# Altium schematic sheet imx6_unused_pin.SchDoc
size A4; SheetNumber: 21; SheetTotal: 21
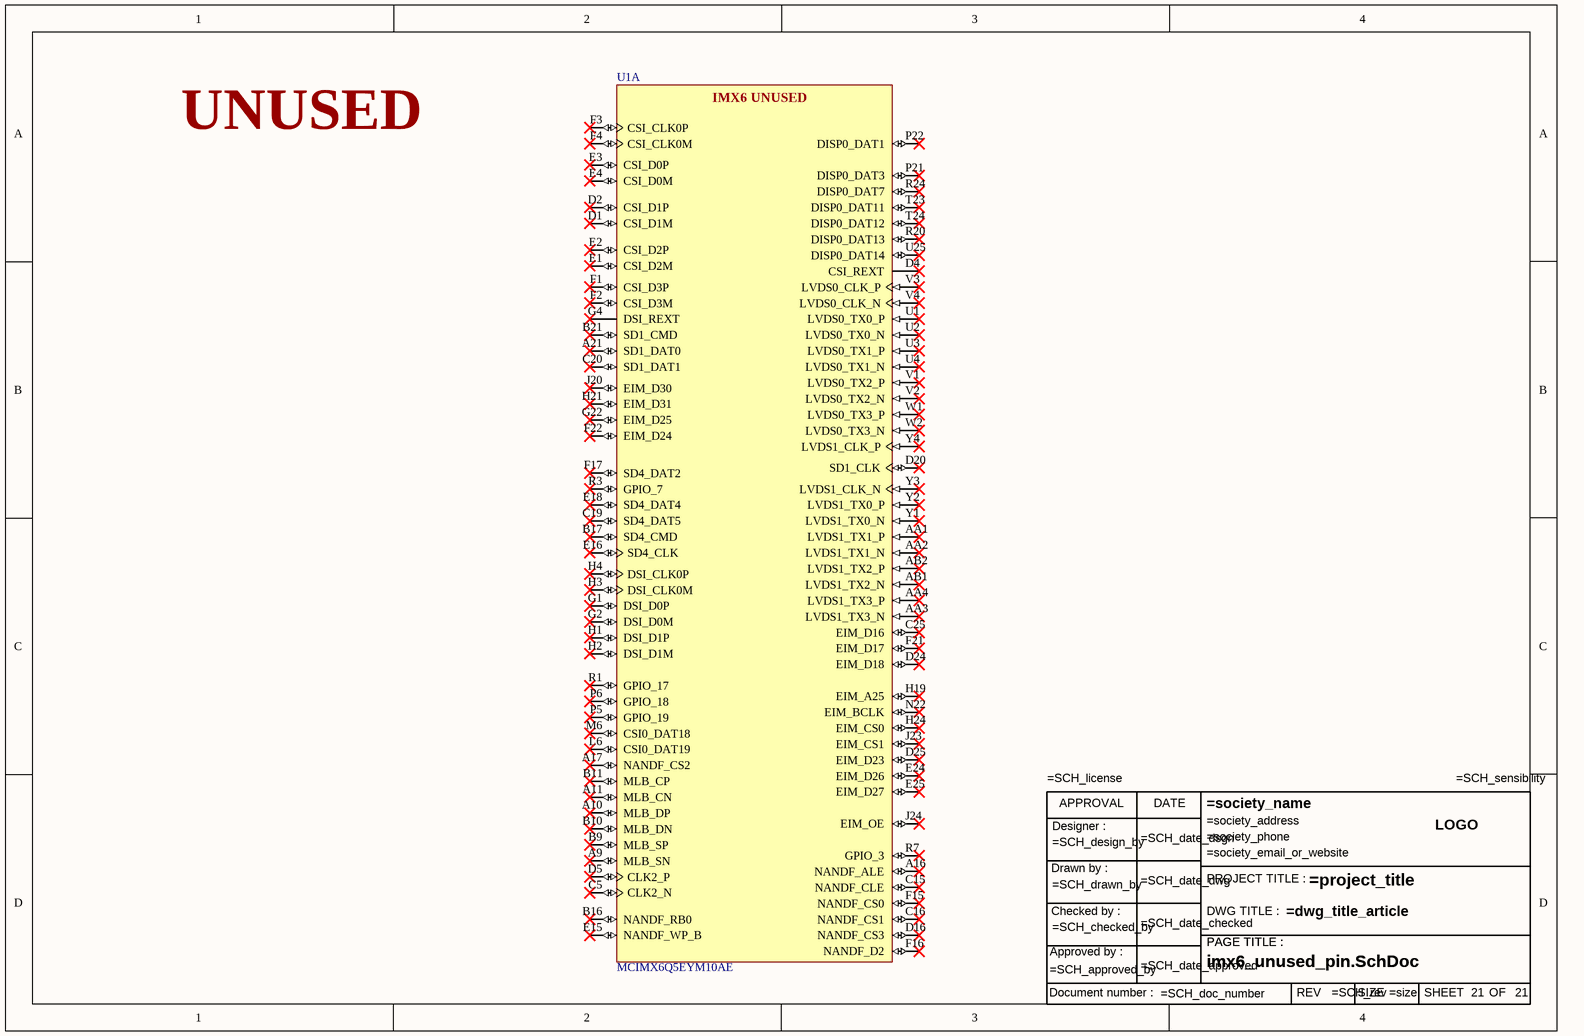
[diagram p0: imx6_unused_pin.SchDoc]

## Parts
TB22  Title bloc ANSI modified  (value not drawn)
U1  MCIMX6Q5EYM10AE  [FRES-2197-01]  (part A of 21)

## Nets

Not connected (* = marked no-connect by the designer): U1 A9(MLB_SN)* A10(MLB_DP)* A11(MLB_CN)* A16(NANDF_ALE)* A17(NANDF_CS2)* A21(SD1_DAT0)* AA1(LVDS1_TX1_P)* AA2(LVDS1_TX1_N)* AA3(LVDS1_TX3_N)* AA4(LVDS1_TX3_P)* AB1(LVDS1_TX2_N)* AB2(LVDS1_TX2_P)* B9(MLB_SP)* B10(MLB_DN)* B11(MLB_CP)* B16(NANDF_RB0)* B17(SD4_CMD)* B21(SD1_CMD)* C5(CLK2_N)* C15(NANDF_CLE)* C16(NANDF_CS1)* C19(SD4_DAT5)* C20(SD1_DAT1)* C25(EIM_D16)* D1(CSI_D1M)* D2(CSI_D1P)* D4(CSI_REXT)* D5(CLK2_P)* D16(NANDF_CS3)* D20(SD1_CLK)* D24(EIM_D18)* D25(EIM_D23)* E1(CSI_D2M)* E2(CSI_D2P)* E3(CSI_D0P)* E4(CSI_D0M)* E15(NANDF_WP_B)* E16(SD4_CLK)* E18(SD4_DAT4)* E24(EIM_D26)* E25(EIM_D27)* F1(CSI_D3P)* F2(CSI_D3M)* F3(CSI_CLK0P)* F4(CSI_CLK0M)* F15(NANDF_CS0)* F16(NANDF_D2)* F17(SD4_DAT2)* F21(EIM_D17)* F22(EIM_D24)* G1(DSI_D0P)* G2(DSI_D0M)* G4(DSI_REXT)* G22(EIM_D25)* H1(DSI_D1P)* H2(DSI_D1M)* H3(DSI_CLK0M)* H4(DSI_CLK0P)* H19(EIM_A25)* H21(EIM_D31)* H24(EIM_CS0)* J20(EIM_D30)* J23(EIM_CS1)* J24(EIM_OE)* L6(CSI0_DAT19)* M6(CSI0_DAT18)* N22(EIM_BCLK)* P5(GPIO_19)* P6(GPIO_18)* P21(DISP0_DAT3)* P22(DISP0_DAT1)* R1(GPIO_17)* R3(GPIO_7)* R7(GPIO_3)* R20(DISP0_DAT13)* R24(DISP0_DAT7)* T23(DISP0_DAT11)* T24(DISP0_DAT12)* U1(LVDS0_TX0_P)* U2(LVDS0_TX0_N)* U3(LVDS0_TX1_P)* U4(LVDS0_TX1_N)* U25(DISP0_DAT14)* V1(LVDS0_TX2_P)* V2(LVDS0_TX2_N)* V3(LVDS0_CLK_P)* V4(LVDS0_CLK_N)* W1(LVDS0_TX3_P)* W2(LVDS0_TX3_N)* Y1(LVDS1_TX0_N)* Y2(LVDS1_TX0_P)* Y3(LVDS1_CLK_N)* Y4(LVDS1_CLK_P)*

## Notes on the sheet
- UNUSED
- (in symbol IMX6Q5EYM10AE, part A) IMX6 UNUSED
- (in symbol Title bloc ANSI) APPROVAL; DATE; Designer :; LOGO; Drawn by :; PROJECT TITLE :; Checked by :; DWG TITLE :; PAGE TITLE :; Approved by :; Document number :; REV; SIZE; SHEET; OF

## Library data of the parts
TB22 = Title bloc ANSI
U1 = IMX6Q5EYM10AE: 32-Bit i.MX 6 Quad Application Processor, 1 GHz, 256 KB RAM, Extended Consumer Grade, 624-Pin FCPBGA, RoHS, Tape and Reel; PartNumber: MCIMX6Q5EYM10ACR; Manufacturer: Freescale Semiconductor; CAN: FlexCAN; Number of Cores: 4 Spec; External Memory Supported: DDR3, DDR3L, FLASH, LPDDR2; Speed Grade: 1 GHz; Core Type: ARM Cortex A9; Cache (KB): 32; Ethernet: 1 Gbps + IEEE 1588; Internal RAM (KB): 256; ComponentLink1Description: Manufacturer URL; ComponentLink2Description: Datasheet; DatasheetVersion: Rev. 2.3; ComponentLink3URL: http://cache.freescale.com/files/32bit/doc/data_sheet/IMX6DQCEC.pdf?fpsp=1&WT_TYPE=Data%20Sheets&WT_VENDOR=FREESCALE&WT_FILE_FORMAT=pdf&WT_ASSET=Documentation; ComponentLink1URL: http://www.freescale.com/; Packing: Tape and Reel; Temperature Range: -20 to 105 degC; ComponentLink2URL: http://cache.freescale.com/files/32bit/doc/data_sheet/IMX6DQCEC.pdf?fpsp=1&WT_TYPE=Data%20Sheets&WT_VENDOR=FREESCALE&WT_FILE_FORMAT=pdf&WT_ASSET=Documentation; ComponentLink3Description: Package Specification; PackageVersion: Rev. A; RoHS: TRUE; Quad/Dual CPU: i.MX 6Quad; Mounting Technology: Surface Mount; PackageReference: FCPBGA-624; PackageDescription: 624-pin Ball Grid Array Package, Body 21 x 21mm, Pitch 0.8mm